# EAGLE schematic follower 2013-3 (EAGLE 6.3)
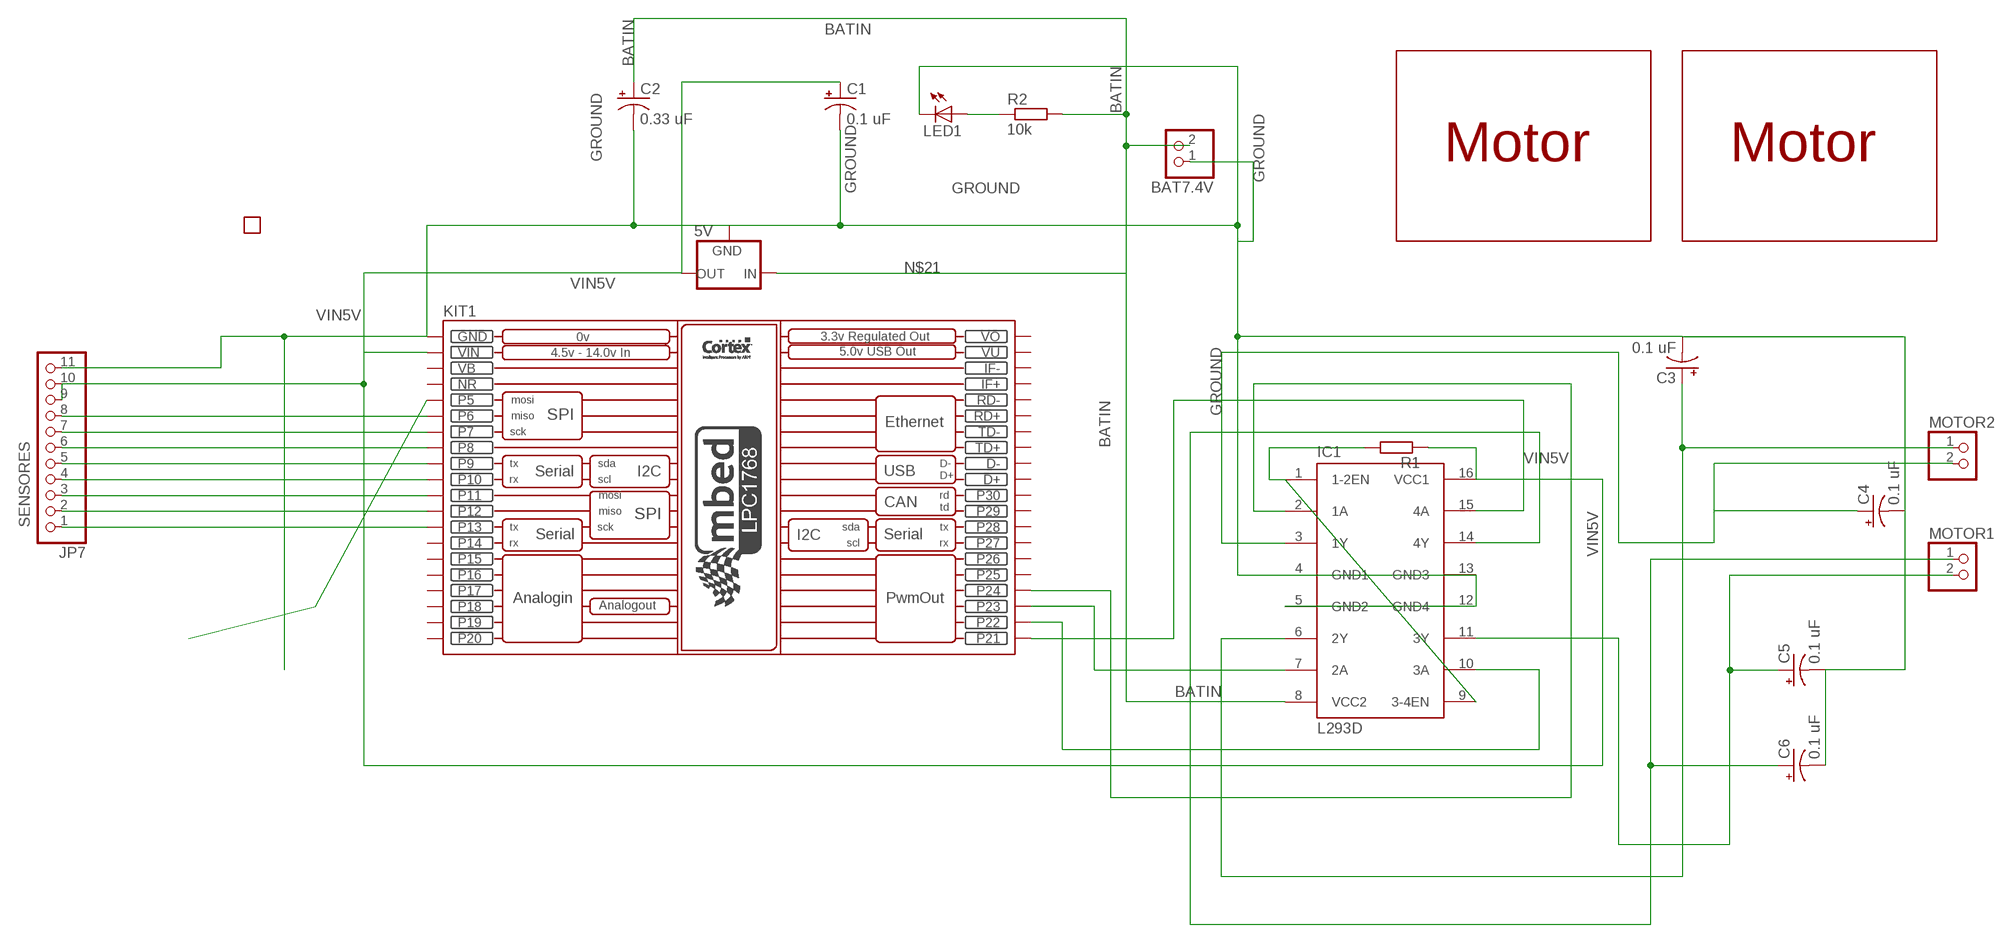
[diagram p0: schematic, sheet 1]

## Parts
5V  78XXL  [78XXL]
BAT7.4V  PINHD-1X2  [1X02]
C1  0.1 uF  CPOL-USTT6D6  [TT5D6]
C2  0.33 uF  CPOL-USTT6D6  [TT5D6]
C3  0.1 uF  CPOL-USTT6D6  [TT5D6]
C4  0.1 uF  CPOL-USTT6D6  [TT5D6]
C5  0.1 uF  CPOL-USTT6D6  [TT5D6]
C6  0.1 uF  CPOL-USTT6D6  [TT5D6]
IC1  L293D  [DIL16]
JP7  PINHD-1X11  [1X11]
KIT1  MBED_NXP_LPC1768  [MBED-KIT]
LED1  LED3MM  [LED3MM]
MOTOR1  PINHD-1X2  [1X02]
MOTOR2  PINHD-1X2  [1X02]
R1  R-EU_0204/2V  [0204V]
R2  10k  R-EU_0204/5  [0204/5]
U$1  BATERIA7.4V  [BATERIA7.4V]
U$2  MOTOR  [MOTOR]
U$3  MOTOR  [MOTOR]

## Nets
BATIN: BAT7.4V.2 C2.+ IC1.8(VCC2) R2.2
GROUND: 5V.GND BAT7.4V.1 C1.- C2.- C3.- C4.- C5.- C6.- IC1.4(GND1) IC1.5(GND2) IC1.12(GND4) IC1.13(GND3) JP7.11(S8) KIT1.GND LED1.K(C)
MOTOR2: C4.+ IC1.3(1Y) MOTOR2.2
N$1: KIT1.P$5(P5)
N$2: IC1.15(4A) KIT1.P$21(P21)
N$3: IC1.7(2A) KIT1.P$23(P23)
N$4: IC1.1(1-2EN) IC1.9(3-4EN) R1.2
N$5: IC1.10(3A) KIT1.P$22(P22)
N$6: IC1.2(1A) KIT1.P$24(P24)
N$8: C3.+ IC1.6(2Y) MOTOR2.1
N$9: C5.+ IC1.11(3Y) MOTOR1.2
N$10: C6.+ IC1.14(4Y) MOTOR1.1
N$11: JP7.8(S5) KIT1.P$6(P6)
N$12: JP7.7(S4) KIT1.P$7(P7)
N$13: JP7.6(S3) KIT1.P$8(P8)
N$14: JP7.5(S2) KIT1.P$9(P9)
N$15: JP7.4(S1) KIT1.P$10(P10)
N$16: JP7.3(VCCLED) KIT1.P$11(P11)
N$17: JP7.2(VCC) KIT1.P$12(P12)
N$19: LED1.A R2.1
N$21: 5V.IN
SENSORES: JP7.1(GND) KIT1.P$13(P13)
VIN5V: 5V.OUT C1.+ IC1.16(VCC1) JP7.9(S6) JP7.10(S7) KIT1.VIN R1.1
Unconnected: KIT1.D+ KIT1.D- KIT1.IF+ KIT1.IF- KIT1.P$14(P14) KIT1.P$15(P15) KIT1.P$16(P16) KIT1.P$17(P17) KIT1.P$18(P18) KIT1.P$19(P19) KIT1.P$20(P20) KIT1.P$25(P25) KIT1.P$26(P26) KIT1.P$27(P27) KIT1.P$28(P28) KIT1.P$29(P29) KIT1.P$30(P30) KIT1.RD+ KIT1.RD- KIT1.TD+ KIT1.TD-

## Power pins joined to a net without a drawn wire
NR: KIT1.NR
VB: KIT1.VB
VO: KIT1.VOUT(VO)
VU: KIT1.VU

## Library data of the parts
5V = v-reg:78XXL: VOLTAGE REGULATOR
BAT7.4V MOTOR1 MOTOR2 = pinhead:PINHD-1X2: PIN HEADER
C1-C6 = resistor:CPOL-US: POLARIZED CAPACITOR, American symbol
IC1 = st-microelectronics:L293D: PUSH-PULL 4 CHANNEL DRIVER; MPN: L293D; OC_FARNELL: 9589619; OC_NEWARK: 56P8249
JP7 = sensorbar:PINHD-1X11: PIN HEADER
KIT1 = MBED_v2.1:MBED_NXP_LPC1768: Mbed LPC1768 - ARM CORTEX v2.1 * Schematic symbol is now placed in eagles's default raster. *The pads diameter are suitable for routing between mbed pins * mbed pads are 0.8 mm drill diameter. --------------------------------------------- Created by: Mohamed Yousry *Alexandria, Egypt *Email: mohamed.yousry@ieeegoldegypt.org
LED1 = led:LED: LED OSRAM: - CHIPLED LG R971, LG N971, LY N971, LG Q971, LY Q971, LO R971, LY R971 LH N974, LH R974 LS Q976, LO Q976, LY Q976 LO Q996 - Hyper CHIPLED LW Q18S LB Q993, LB Q99A, LB R99A - SideLED LS A670, LO A670, LY A670, LG A670, LP A670 LB A673, LV A673, LT A673, LW A673 LH A674 LY A675 LS A676, LA A676, LO A676, LY A676, LW A676 LS A679, LY A679, LG A679 - Hyper Micro SIDELED® LS Y876, LA Y876, LO Y876, LY Y876 LT Y87S - SmartLED LW L88C, LW L88S LB L89C, LB L89S, LG L890 LS L89K, LO L89K, LY L89K LS L896, LA L896, LO L896, LY L896 - TOPLED LS T670, LO T670, LY T670, LG T670, LP T670 LSG T670, LSP T670, LSY T670, LOP T670, LYG T670 LG T671, LOG T671, LSG T671 LB T673, LV T673, LT T673, LW T673 LH T674 LS T676, LA T676, LO T676, LY T676, LB T676, LH T676, LSB T676, LW T676 LB T67C, LV T67C, LT T67C, LS T67K, LO T67K, LY T67K, LW E67C LS E67B, LA E67B, LO E67B, LY E67B, LB E67C, LV E67C, LT E67C LW T67C LS T679, LY T679, LG T679 LS T770, LO T770, LY T770, LG T770, LP T770 LB T773, LV T773, LT T773, LW T773 LH T774 LS E675, LA E675, LY E675, LS T675 LS T776, LA T776, LO T776, LY T776, LB T776 LHGB T686 LT T68C, LB T68C - Hyper Mini TOPLED® LB M676 - Mini TOPLED Santana® LG M470 LS M47K, LO M47K, LY M47K Source: http://www.osram.convergy.de LUXEON: - LUMILED® LXK2-PW12-R00, LXK2-PW12-S00, LXK2-PW14-U00, LXK2-PW14-V00 LXK2-PM12-R00, LXK2-PM12-S00, LXK2-PM14-U00 LXK2-PE12-Q00, LXK2-PE12-R00, LXK2-PE12-S00, LXK2-PE14-T00, LXK2-PE14-U00 LXK2-PB12-K00, LXK2-PB12-L00, LXK2-PB12-M00, LXK2-PB14-N00, LXK2-PB14-P00, LXK2-PB14-Q00 LXK2-PR12-L00, LXK2-PR12-M00, LXK2-PR14-Q00, LXK2-PR14-R00 LXK2-PD12-Q00, LXK2-PD12-R00, LXK2-PD12-S00 LXK2-PH12-R00, LXK2-PH12-S00 LXK2-PL12-P00, LXK2-PL12-Q00, LXK2-PL12-R00 Source: www.luxeon.com KINGBRIGHT: KA-3528ASYC Source: www.kingbright.com
R1 R2 = rcl:R-EU_: RESISTOR, European symbol
U$1 = bateria:BATERIA7.4V
U$2 U$3 = motor:MOTOR